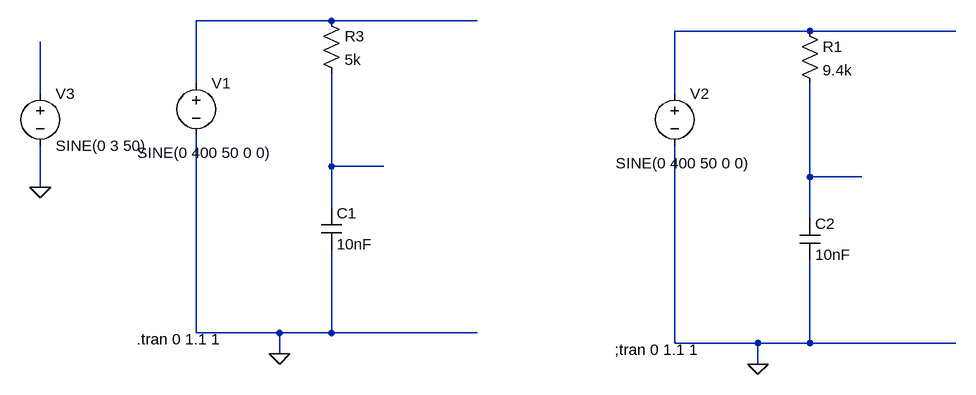
[diagram p0: schematic Draft1.asc]
Draft1.asc, the LTspice schematic file:
Version 4
SHEET 1 948 680
WIRE -16 48 -224 48
WIRE 208 48 -16 48
WIRE 720 64 512 64
WIRE 944 64 720 64
WIRE -224 144 -224 48
WIRE -464 160 -464 80
WIRE 512 160 512 64
WIRE -16 272 -16 128
WIRE 64 272 -16 272
WIRE 720 288 720 144
WIRE 800 288 720 288
WIRE -464 304 -464 240
WIRE -16 336 -16 272
WIRE 720 352 720 288
WIRE -224 528 -224 224
WIRE -96 528 -224 528
WIRE -16 528 -16 400
WIRE -16 528 -96 528
WIRE 208 528 -16 528
WIRE 512 544 512 240
WIRE 640 544 512 544
WIRE 720 544 720 416
WIRE 720 544 640 544
WIRE 944 544 720 544
WIRE -96 560 -96 528
WIRE 640 576 640 544
FLAG -96 560 0
FLAG 640 576 0
FLAG -464 304 0
SYMBOL voltage -224 128 R0
WINDOW 3 -91 123 Left 2
WINDOW 123 0 0 Left 0
WINDOW 39 0 0 Left 0
SYMATTR InstName V1
SYMATTR Value SINE(0 400 50 0 0)
SYMBOL res -32 32 R0
SYMATTR InstName R3
SYMATTR Value 5k
SYMBOL cap -32 336 R0
SYMATTR InstName C1
SYMATTR Value 10nF
SYMBOL voltage 512 144 R0
WINDOW 3 -91 123 Left 2
WINDOW 123 0 0 Left 0
WINDOW 39 0 0 Left 0
SYMATTR InstName V2
SYMATTR Value SINE(0 400 50 0 0)
SYMBOL res 704 48 R0
SYMATTR InstName R1
SYMATTR Value 9.4k
SYMBOL cap 704 352 R0
SYMATTR InstName C2
SYMATTR Value 10nF
SYMBOL voltage -464 144 R0
WINDOW 123 0 0 Left 0
WINDOW 39 0 0 Left 0
SYMATTR InstName V3
SYMATTR Value SINE(0 3 50)
TEXT -316 538 Left 2 !.tran 0 1.1 1
TEXT 420 554 Left 2 !;tran 0 1.1 1

The netlist it stands for:
* Draft1.asc
V1 N001 0 SINE(0 400 50 0 0)
R3 N001 N004 5k
C1 N004 0 10nF
V2 N002 0 SINE(0 400 50 0 0)
R1 N002 N005 9.4k
C2 N005 0 10nF
V3 N003 0 SINE(0 3 50)
.tran 0 1.1 1
;tran 0 1.1 1
.backanno
.end